# EasyEDA schematic SCH_Copy of car.SchDoc_2023-05-21.json
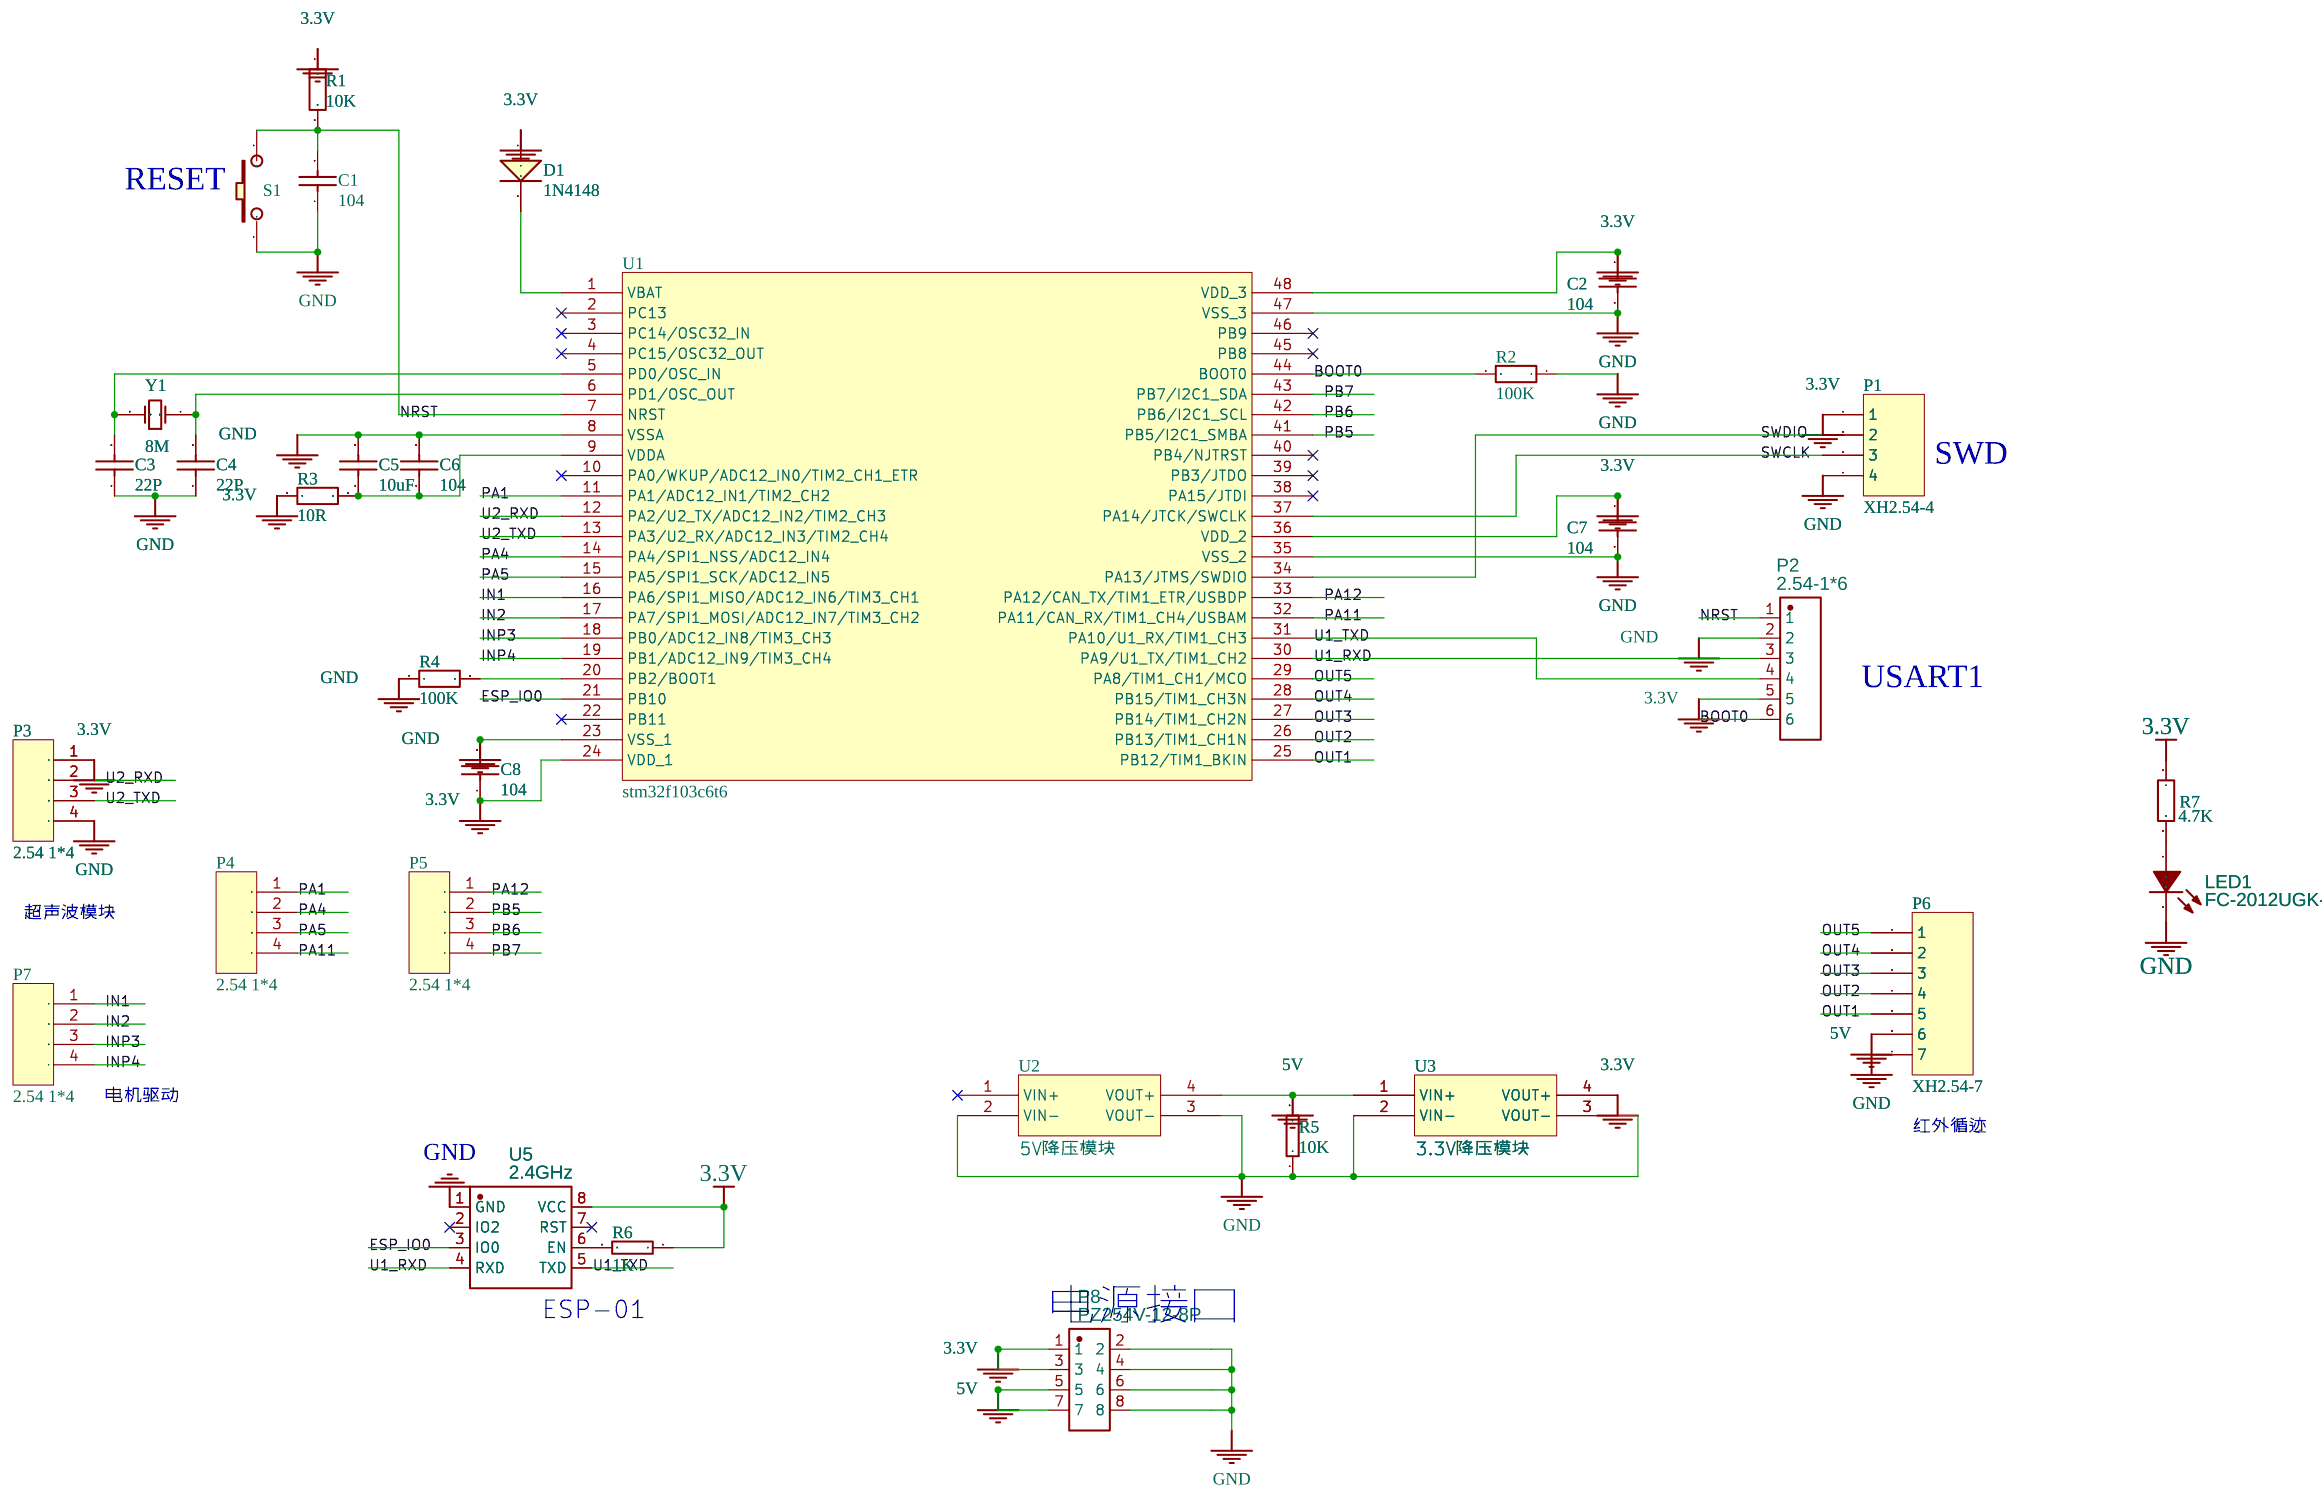
[diagram p0: schematic sheet]

## Parts
C1  104  [0805]
C2  104  [0805]
C3  22P  [0805]
C4  22P  [0805]
C5  10uF  [0805]
C6  104  [0805]
C7  104  [0805]
C8  104  [0805]
D1  1N4148  [______ __Ƭ IN4148]
LED1  FC-2012UGK-520D5  [0805]
P1  XH2.54-4  [VH2.54_4]
P2  2.54-1*6  [HDR-TH_6P-P2.54-V-M]
P3  2.54 1*4  [___Ų___ 2.54 1*4]
P4  2.54 1*4  [___Ų___ 2.54 1*4]
P5  2.54 1*4  [___Ų___ 2.54 1*4]
P6  XH2.54-7  [VH2.54_7]
P7  2.54 1*4  [___Ų___ 2.54 1*4]
P8  PZ254V-12-8P  [HDR-TH_8P-P2.54-V-M-R2-C4-S2.54]
R1  10K  [0805]
R2  100K  [0805]
R3  10R  [0805]
R4  100K  [0805]
R5  10K  [0805]
R6  1K  [0805]
R7  4.7K  [0805]
S1  key  [____ _ᴥ  6*3]
U1  stm32f103c6t6  [LQFP-48_48P-L7.0-W7.0-P0.50-LS9.0-BL]
U2  5V降压模块  [MOTOR-DRIVE]
U3  3.3V降压模块  [MOTOR-DRIVE]
U5  2.4GHz  [WIFIM-TH_8P-L24.7-W14.4-P2.54]
Y1  8M  [____ BCY-W2/E4.7]

## Library data of the parts
C1-C8 = -: 名称: 贴片电容; 封装: 0603; 单位: 个
D1 = -: 名称: 贴片二极管; 封装: 1206; 单位: 个
LED1 = FC-2012UGK-520D5: Supplier: LCSC; Manufacturer: 国星光电; Manufacturer Part: NCD0805G1; Supplier Part: C84260; JLCPCB Part Class: Extended Part
P1 P6 = -: 名称: 联结件; 单位: 套
P2 = 2.54-1*6: Supplier: LCSC; Supplier Part: C5156615; Manufacturer: ZHOURI(洲日); link: https://atta.szlcsc.com/upload/public/pdf/source/20220915/8E4DB922105F740C573E07AD79C5CA29.pdf; JLCPCB Part Class: Extended Part; Contributor: lcsc
P3-P5 P7 = -: 单位: 片; 封装: DIP; 名称: 单排插针
P8 = PZ254V-12-8P: Supplier: LCSC; Supplier Part: C492421; Manufacturer: XFCN(兴飞); Contributor: LCSC; JLCPCB Part Class: Extended Part
R1 R3 = -: 名称: 贴片电阻; 封装: 0603; 单位: 个
R2 R4-R7 = -: 名称: 贴片电阻; 单位: 个
S1 = -: 单位: 个; 名称: 开关; 封装: 直插 12*12*12
U5 = ESP-01: Supplier: LCSC; Supplier Part: C503581; Manufacturer: Ai-Thinker(安信可); Contributor: LCSC; JLCPCB Part Class: Extended Part
Y1 = -: 名称: 晶振; 封装: 直插矮; 单位: 个

## Nets
3.3V: C2.1 C7.1 C8.1 D1.1(A) P1.1 P2.5 P3.1 P8.1 P8.3 R1.1 R3.1 R6.1 R7.1 U1.24(VDD_1) U1.36(VDD_2) U1.48(VDD_3) U3.4(VOUT+) U5.8(VCC)
5V: P6.6 P8.5 P8.7 R5.2 U2.4(VOUT+) U3.1(VIN+)
GND: C1.1 C2.2 C3.1 C4.1 C5.2 C6.2 C7.2 C8.2 LED1.2(K) P1.4 P2.2 P3.4 P6.7 P8.2 P8.4 P8.6 P8.8 R2.1 R4.1 R5.1 S1.1 U1.8(VSSA) U1.23(VSS_1) U1.35(VSS_2) U1.47(VSS_3) U2.2(VIN-) U2.3(VOUT-) U3.2(VIN-) U3.3(VOUT-) U5.1(GND)
BOOT0: P2.6 R2.2 U1.44(BOOT0)
ESP_IO0: U1.21(PB10) U5.3(IO0)
IN1: P7.1 U1.16(PA6/SPI1_MISO/ADC12_IN6/TIM3_CH1)
IN2: P7.2 U1.17(PA7/SPI1_MOSI/ADC12_IN7/TIM3_CH2)
INP3: P7.3 U1.18(PB0/ADC12_IN8/TIM3_CH3)
INP4: P7.4 U1.19(PB1/ADC12_IN9/TIM3_CH4)
NRST: C1.2 P2.1 R1.2 S1.2 U1.7(NRST)
OUT1: P6.5 U1.25(PB12/TIM1_BKIN)
OUT2: P6.4 U1.26(PB13/TIM1_CH1N)
OUT3: P6.3 U1.27(PB14/TIM1_CH2N)
OUT4: P6.2 U1.28(PB15/TIM1_CH3N)
OUT5: P6.1 U1.29(PA8/TIM1_CH1/MCO)
PA1: P4.1 U1.11(PA1/ADC12_IN1/TIM2_CH2)
PA4: P4.2 U1.14(PA4/SPI1_NSS/ADC12_IN4)
PA5: P4.3 U1.15(PA5/SPI1_SCK/ADC12_IN5)
PA11: P4.4 U1.32(PA11/CAN_RX/TIM1_CH4/USBAM)
PA12: P5.1 U1.33(PA12/CAN_TX/TIM1_ETR/USBDP)
PB5: P5.2 U1.41(PB5/I2C1_SMBA)
PB6: P5.3 U1.42(PB6/I2C1_SCL)
PB7: P5.4 U1.43(PB7/I2C1_SDA)
SWCLK: P1.3 U1.37(PA14/JTCK/SWCLK)
SWDIO: P1.2 U1.34(PA13/JTMS/SWDIO)
U1_RXD: P2.3 U1.30(PA9/U1_TX/TIM1_CH2) U5.4(RXD)
U1_TXD: P2.4 U1.31(PA10/U1_RX/TIM1_CH3) U5.5(TXD)
U2_RXD: P3.2 U1.12(PA2/U2_TX/ADC12_IN2/TIM2_CH3)
U2_TXD: P3.3 U1.13(PA3/U2_RX/ADC12_IN3/TIM2_CH4)
Net-(C3-2): C3.2 U1.5(PD0/OSC_IN) Y1.2(OSC2)
Net-(C4-2): C4.2 U1.6(PD1/OSC_OUT) Y1.1(OSC1)
Net-(C5-1): C5.1 C6.1 R3.2 U1.9(VDDA)
Net-(D1-2): D1.2(K) U1.1(VBAT)
Net-(LED1-1): LED1.1(A) R7.2
Net-(R4-2): R4.2 U1.20(PB2/BOOT1)
Net-(R6-2): R6.2 U5.6(EN)

Not connected (* = marked no-connect by the designer): U1 2(PC13)* 3(PC14/OSC32_IN)* 4(PC15/OSC32_OUT)* 10(PA0/WKUP/ADC12_IN0/TIM2_CH1_ETR)* 22(PB11)* 38(PA15/JTDI)* 39(PB3/JTDO)* 40(PB4/NJTRST)* 45(PB8)* 46(PB9)*; U2 1(VIN+)*; U5 2(IO2)* 7(RST)*

## Notes on the sheet
- RESET
- SWD
- USART1
- 超声波模块
- 电机驱动
- 红外循迹
- ESP-01
- 电源接口
